# Altium schematic sheet SoC_Supply_GND.SchDoc: RFSoC AMC
size 420 x 297 mm; CompanyName: WUT; DrawnBy: T. Przywozki; Organization: WUT ISE; Address1: Warsaw University of Technology; Address2: Nowowiejska 15/19 00-665 Warsaw; Address3: Tomasz.Przywozki@pw.edu.pl; DocumentNumber: 13; Revision: 1; SheetNumber: 13; SheetTotal: 45; Project: RFSoC AMC; ModifiedBy: T. Przywozki; CreateDate: -; CheckedDate: -; DivGrp: ISE; Designer: T. Przywozki; ModifiedDate: -; ProjectName: ADC/DAC MEZZANINE
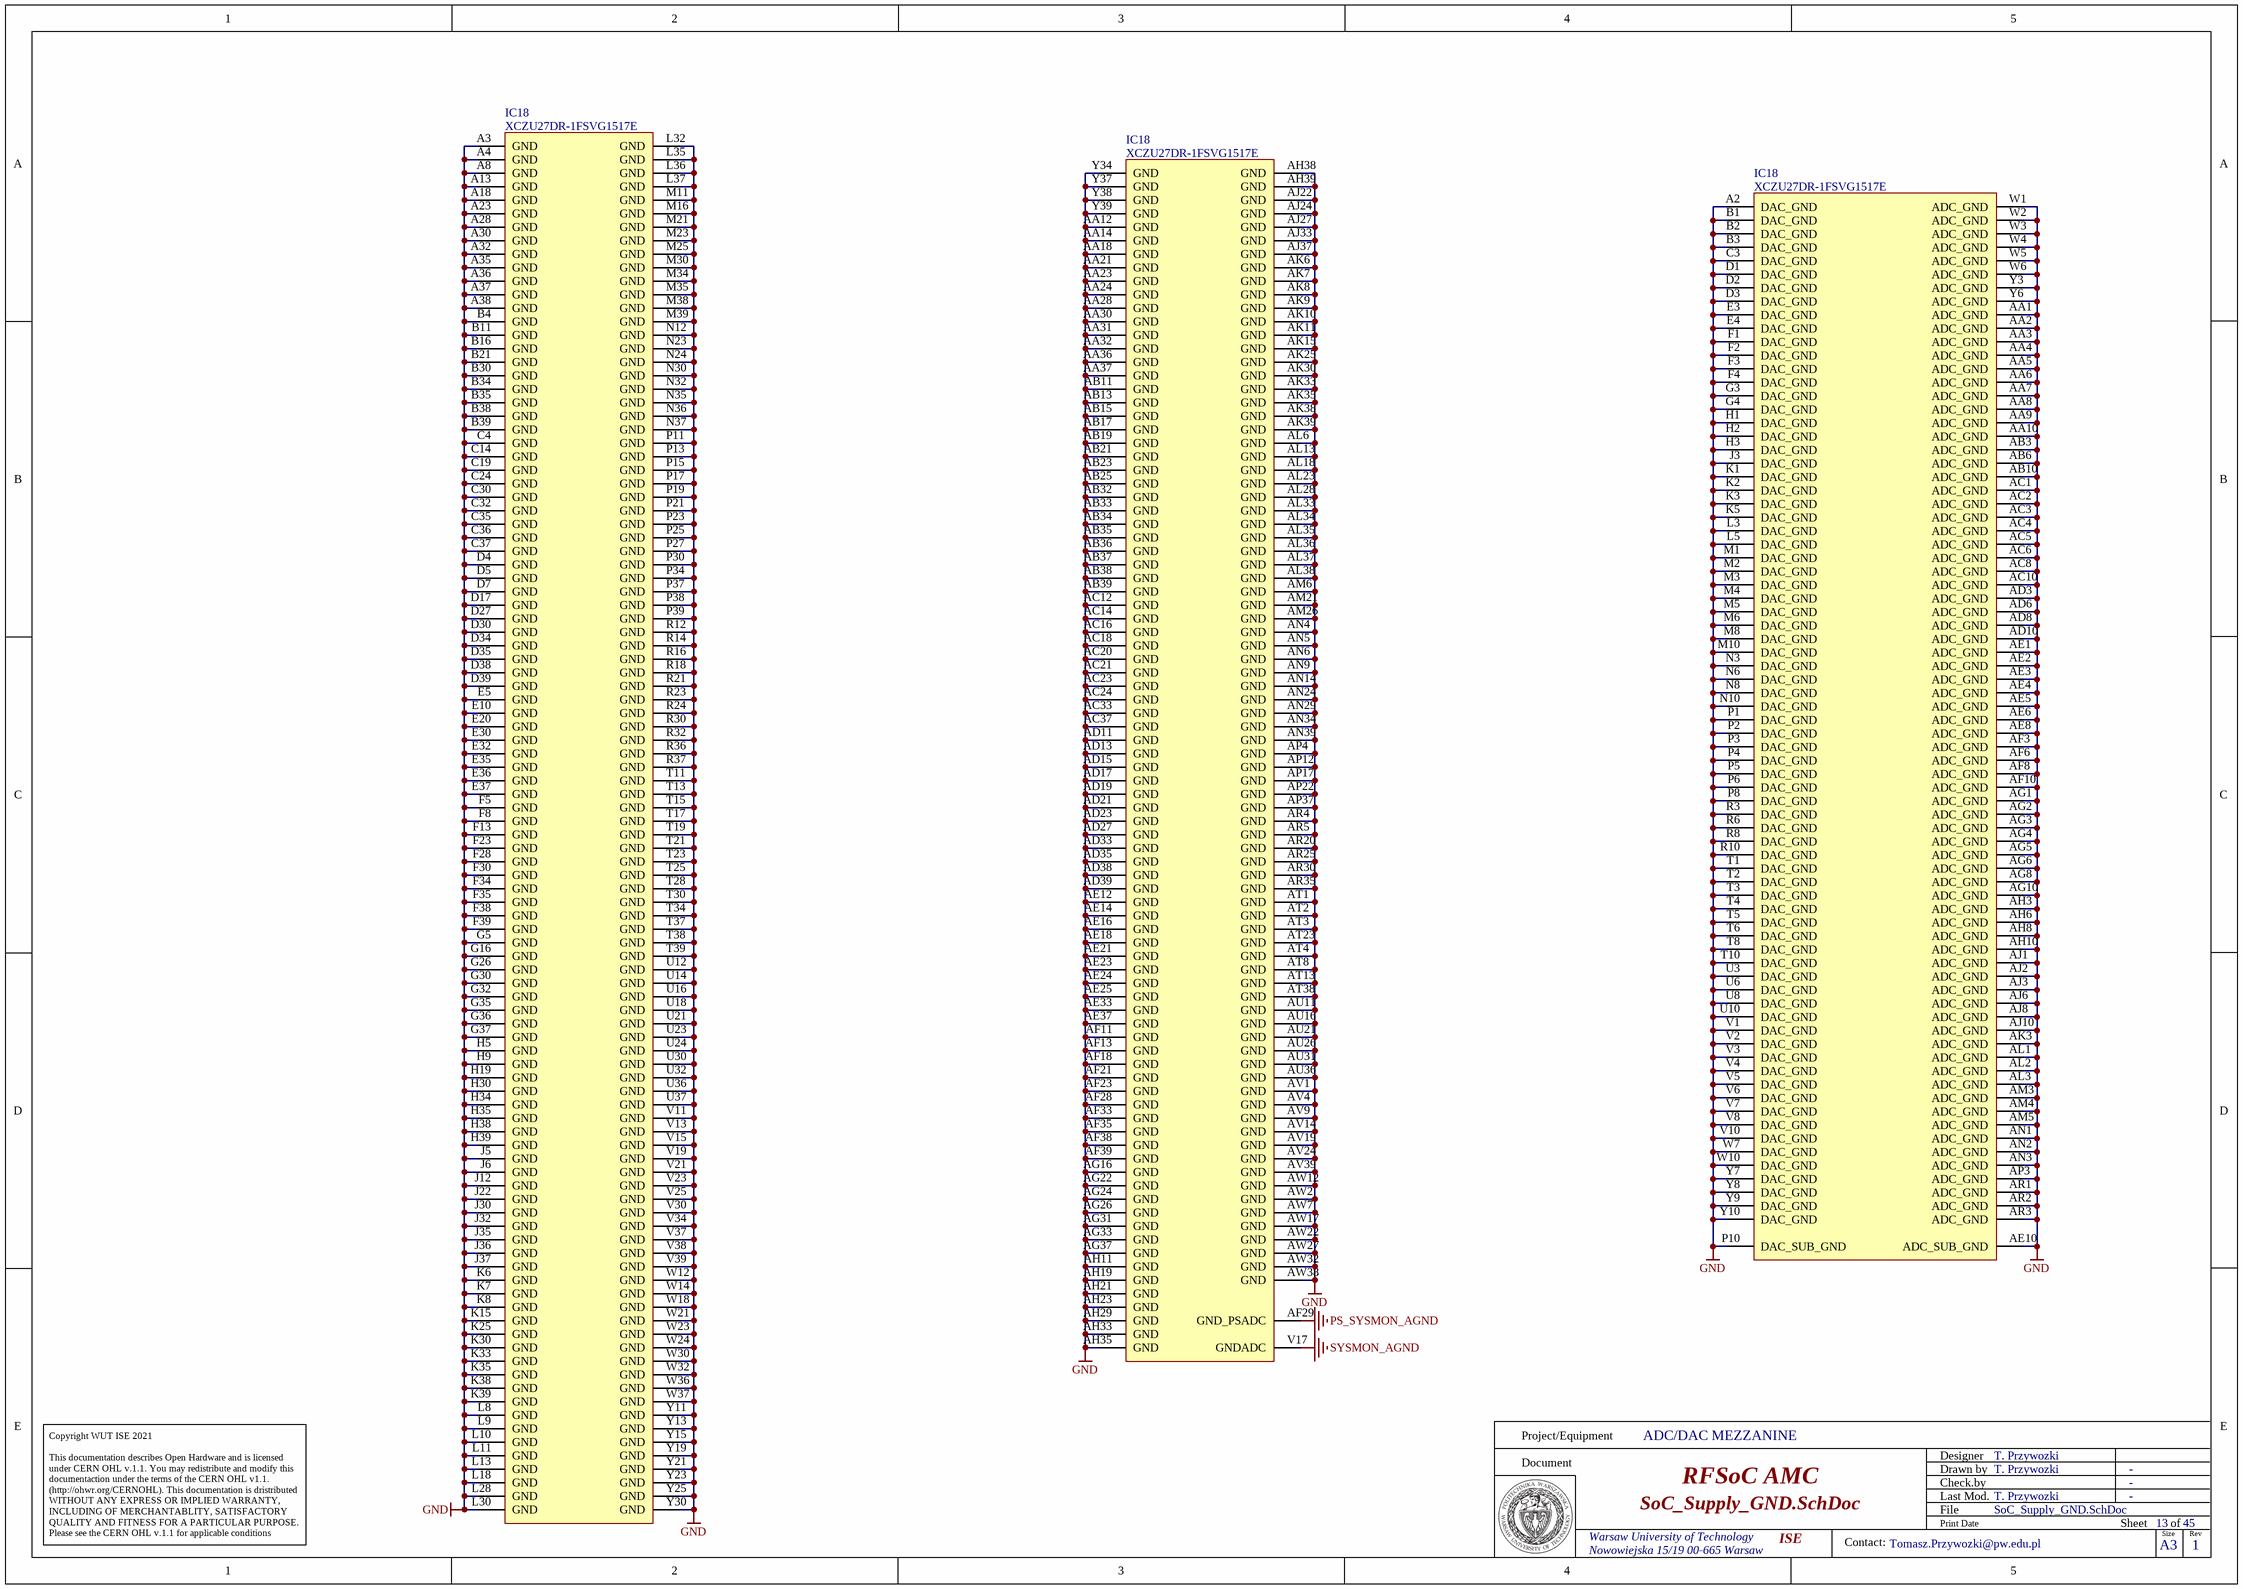
[diagram p0: SoC_Supply_GND.SchDoc]

## Parts
IC18  XCZU27DR-1FSVG1517E  [XILINX_FSVG1517 (XCZU27DR)]  (parts 29,30,31 of 31)

## Nets
GND: IC18.A2(DAC_GND) IC18.A3(GND) IC18.A4(GND) IC18.A8(GND) IC18.A13(GND) IC18.A18(GND) IC18.A23(GND) IC18.A28(GND) IC18.A30(GND) IC18.A32(GND) IC18.A35(GND) IC18.A36(GND) IC18.A37(GND) IC18.A38(GND) IC18.AA1(ADC_GND) IC18.AA2(ADC_GND) IC18.AA3(ADC_GND) IC18.AA4(ADC_GND) IC18.AA5(ADC_GND) IC18.AA6(ADC_GND) IC18.AA7(ADC_GND) IC18.AA8(ADC_GND) IC18.AA9(ADC_GND) IC18.AA10(ADC_GND) IC18.AA12(GND) IC18.AA14(GND) IC18.AA18(GND) IC18.AA21(GND) IC18.AA23(GND) IC18.AA24(GND) IC18.AA28(GND) IC18.AA30(GND) IC18.AA31(GND) IC18.AA32(GND) IC18.AA36(GND) IC18.AA37(GND) IC18.AB3(ADC_GND) IC18.AB6(ADC_GND) IC18.AB10(ADC_GND) IC18.AB11(GND) IC18.AB13(GND) IC18.AB15(GND) IC18.AB17(GND) IC18.AB19(GND) IC18.AB21(GND) IC18.AB23(GND) IC18.AB25(GND) IC18.AB32(GND) IC18.AB33(GND) IC18.AB34(GND) IC18.AB35(GND) IC18.AB36(GND) IC18.AB37(GND) IC18.AB38(GND) IC18.AB39(GND) IC18.AC1(ADC_GND) IC18.AC2(ADC_GND) IC18.AC3(ADC_GND) IC18.AC4(ADC_GND) IC18.AC5(ADC_GND) IC18.AC6(ADC_GND) IC18.AC8(ADC_GND) IC18.AC10(ADC_GND) IC18.AC12(GND) IC18.AC14(GND) IC18.AC16(GND) IC18.AC18(GND) IC18.AC20(GND) IC18.AC21(GND) IC18.AC23(GND) IC18.AC24(GND) IC18.AC33(GND) IC18.AC37(GND) IC18.AD3(ADC_GND) IC18.AD6(ADC_GND) IC18.AD8(ADC_GND) IC18.AD10(ADC_GND) IC18.AD11(GND) IC18.AD13(GND) IC18.AD15(GND) IC18.AD17(GND) IC18.AD19(GND) IC18.AD21(GND) IC18.AD23(GND) IC18.AD27(GND) IC18.AD33(GND) IC18.AD35(GND) IC18.AD38(GND) IC18.AD39(GND) IC18.AE1(ADC_GND) IC18.AE2(ADC_GND) IC18.AE3(ADC_GND) IC18.AE4(ADC_GND) IC18.AE5(ADC_GND) IC18.AE6(ADC_GND) IC18.AE8(ADC_GND) IC18.AE10(ADC_SUB_GND) IC18.AE12(GND) IC18.AE14(GND) IC18.AE16(GND) IC18.AE18(GND) IC18.AE21(GND) IC18.AE23(GND) IC18.AE24(GND) IC18.AE25(GND) IC18.AE33(GND) IC18.AE37(GND) IC18.AF3(ADC_GND) IC18.AF6(ADC_GND) IC18.AF8(ADC_GND) IC18.AF10(ADC_GND) IC18.AF11(GND) IC18.AF13(GND) IC18.AF18(GND) IC18.AF21(GND) IC18.AF23(GND) IC18.AF28(GND) IC18.AF33(GND) IC18.AF35(GND) IC18.AF38(GND) IC18.AF39(GND) IC18.AG1(ADC_GND) IC18.AG2(ADC_GND) IC18.AG3(ADC_GND) IC18.AG4(ADC_GND) IC18.AG5(ADC_GND) IC18.AG6(ADC_GND) IC18.AG8(ADC_GND) IC18.AG10(ADC_GND) IC18.AG16(GND) IC18.AG22(GND) IC18.AG24(GND) IC18.AG26(GND) IC18.AG31(GND) IC18.AG33(GND) IC18.AG37(GND) IC18.AH3(ADC_GND) IC18.AH6(ADC_GND) IC18.AH8(ADC_GND) IC18.AH10(ADC_GND) IC18.AH11(GND) IC18.AH19(GND) IC18.AH21(GND) IC18.AH23(GND) IC18.AH29(GND) IC18.AH33(GND) IC18.AH35(GND) IC18.AH38(GND) IC18.AH39(GND) IC18.AJ1(ADC_GND) IC18.AJ2(ADC_GND) IC18.AJ3(ADC_GND) IC18.AJ6(ADC_GND) IC18.AJ8(ADC_GND) IC18.AJ10(ADC_GND) IC18.AJ22(GND) IC18.AJ24(GND) IC18.AJ27(GND) IC18.AJ33(GND) IC18.AJ37(GND) IC18.AK3(ADC_GND) IC18.AK6(GND) IC18.AK7(GND) IC18.AK8(GND) IC18.AK9(GND) IC18.AK10(GND) IC18.AK11(GND) IC18.AK15(GND) IC18.AK25(GND) IC18.AK30(GND) IC18.AK33(GND) IC18.AK35(GND) IC18.AK38(GND) IC18.AK39(GND) IC18.AL1(ADC_GND) IC18.AL2(ADC_GND) IC18.AL3(ADC_GND) IC18.AL6(GND) IC18.AL13(GND) IC18.AL18(GND) IC18.AL23(GND) IC18.AL28(GND) IC18.AL33(GND) IC18.AL34(GND) IC18.AL35(GND) IC18.AL36(GND) IC18.AL37(GND) IC18.AL38(GND) IC18.AM3(ADC_GND) IC18.AM4(ADC_GND) IC18.AM5(ADC_GND) IC18.AM6(GND) IC18.AM21(GND) IC18.AM26(GND) IC18.AN1(ADC_GND) IC18.AN2(ADC_GND) IC18.AN3(ADC_GND) IC18.AN4(GND) IC18.AN5(GND) IC18.AN6(GND) IC18.AN9(GND) IC18.AN14(GND) IC18.AN24(GND) IC18.AN29(GND) IC18.AN34(GND) IC18.AN39(GND) IC18.AP3(ADC_GND) IC18.AP4(GND) IC18.AP12(GND) IC18.AP17(GND) IC18.AP22(GND) IC18.AP37(GND) IC18.AR1(ADC_GND) IC18.AR2(ADC_GND) IC18.AR3(ADC_GND) IC18.AR4(GND) IC18.AR5(GND) IC18.AR20(GND) IC18.AR25(GND) IC18.AR30(GND) IC18.AR35(GND) IC18.AT1(GND) IC18.AT2(GND) IC18.AT3(GND) IC18.AT4(GND) IC18.AT8(GND) IC18.AT13(GND) IC18.AT23(GND) IC18.AT38(GND) IC18.AU11(GND) IC18.AU16(GND) IC18.AU21(GND) IC18.AU26(GND) IC18.AU31(GND) IC18.AU36(GND) IC18.AV1(GND) IC18.AV4(GND) IC18.AV9(GND) IC18.AV14(GND) IC18.AV19(GND) IC18.AV24(GND) IC18.AV39(GND) IC18.AW2(GND) IC18.AW7(GND) IC18.AW12(GND) IC18.AW17(GND) IC18.AW22(GND) IC18.AW27(GND) IC18.AW32(GND) IC18.AW38(GND) IC18.B1(DAC_GND) IC18.B2(DAC_GND) IC18.B3(DAC_GND) IC18.B4(GND) IC18.B11(GND) IC18.B16(GND) IC18.B21(GND) IC18.B30(GND) IC18.B34(GND) IC18.B35(GND) IC18.B38(GND) IC18.B39(GND) IC18.C3(DAC_GND) IC18.C4(GND) IC18.C14(GND) IC18.C19(GND) IC18.C24(GND) IC18.C30(GND) IC18.C32(GND) IC18.C35(GND) IC18.C36(GND) IC18.C37(GND) IC18.D1(DAC_GND) IC18.D2(DAC_GND) IC18.D3(DAC_GND) IC18.D4(GND) IC18.D5(GND) IC18.D7(GND) IC18.D17(GND) IC18.D27(GND) IC18.D30(GND) IC18.D34(GND) IC18.D35(GND) IC18.D38(GND) IC18.D39(GND) IC18.E3(DAC_GND) IC18.E4(DAC_GND) IC18.E5(GND) IC18.E10(GND) IC18.E20(GND) IC18.E30(GND) IC18.E32(GND) IC18.E35(GND) IC18.E36(GND) IC18.E37(GND) IC18.F1(DAC_GND) IC18.F2(DAC_GND) IC18.F3(DAC_GND) IC18.F4(DAC_GND) IC18.F5(GND) IC18.F8(GND) IC18.F13(GND) IC18.F23(GND) IC18.F28(GND) IC18.F30(GND) IC18.F34(GND) IC18.F35(GND) IC18.F38(GND) IC18.F39(GND) IC18.G3(DAC_GND) IC18.G4(DAC_GND) IC18.G5(GND) IC18.G16(GND) IC18.G26(GND) IC18.G30(GND) IC18.G32(GND) IC18.G35(GND) IC18.G36(GND) IC18.G37(GND) IC18.H1(DAC_GND) IC18.H2(DAC_GND) IC18.H3(DAC_GND) IC18.H5(GND) IC18.H9(GND) IC18.H19(GND) IC18.H30(GND) IC18.H34(GND) IC18.H35(GND) IC18.H38(GND) IC18.H39(GND) IC18.J3(DAC_GND) IC18.J5(GND) IC18.J6(GND) IC18.J12(GND) IC18.J22(GND) IC18.J30(GND) IC18.J32(GND) IC18.J35(GND) IC18.J36(GND) IC18.J37(GND) IC18.K1(DAC_GND) IC18.K2(DAC_GND) IC18.K3(DAC_GND) IC18.K5(DAC_GND) IC18.K6(GND) IC18.K7(GND) IC18.K8(GND) IC18.K15(GND) IC18.K25(GND) IC18.K30(GND) IC18.K33(GND) IC18.K35(GND) IC18.K38(GND) IC18.K39(GND) IC18.L3(DAC_GND) IC18.L5(DAC_GND) IC18.L8(GND) IC18.L9(GND) IC18.L10(GND) IC18.L11(GND) IC18.L13(GND) IC18.L18(GND) IC18.L28(GND) IC18.L30(GND) IC18.L32(GND) IC18.L35(GND) IC18.L36(GND) IC18.L37(GND) IC18.M1(DAC_GND) IC18.M2(DAC_GND) IC18.M3(DAC_GND) IC18.M4(DAC_GND) IC18.M5(DAC_GND) IC18.M6(DAC_GND) IC18.M8(DAC_GND) IC18.M10(DAC_GND) IC18.M11(GND) IC18.M16(GND) IC18.M21(GND) IC18.M23(GND) IC18.M25(GND) IC18.M30(GND) IC18.M34(GND) IC18.M35(GND) IC18.M38(GND) IC18.M39(GND) IC18.N3(DAC_GND) IC18.N6(DAC_GND) IC18.N8(DAC_GND) IC18.N10(DAC_GND) IC18.N12(GND) IC18.N23(GND) IC18.N24(GND) IC18.N30(GND) IC18.N32(GND) IC18.N35(GND) IC18.N36(GND) IC18.N37(GND) IC18.P1(DAC_GND) IC18.P2(DAC_GND) IC18.P3(DAC_GND) IC18.P4(DAC_GND) IC18.P5(DAC_GND) IC18.P6(DAC_GND) IC18.P8(DAC_GND) IC18.P10(DAC_SUB_GND) IC18.P11(GND) IC18.P13(GND) IC18.P15(GND) IC18.P17(GND) IC18.P19(GND) IC18.P21(GND) IC18.P23(GND) IC18.P25(GND) IC18.P27(GND) IC18.P30(GND) IC18.P34(GND) IC18.P37(GND) IC18.P38(GND) IC18.P39(GND) IC18.R3(DAC_GND) IC18.R6(DAC_GND) IC18.R8(DAC_GND) IC18.R10(DAC_GND) IC18.R12(GND) IC18.R14(GND) IC18.R16(GND) IC18.R18(GND) IC18.R21(GND) IC18.R23(GND) IC18.R24(GND) IC18.R30(GND) IC18.R32(GND) IC18.R36(GND) IC18.R37(GND) IC18.T1(DAC_GND) IC18.T2(DAC_GND) IC18.T3(DAC_GND) IC18.T4(DAC_GND) IC18.T5(DAC_GND) IC18.T6(DAC_GND) IC18.T8(DAC_GND) IC18.T10(DAC_GND) IC18.T11(GND) IC18.T13(GND) IC18.T15(GND) IC18.T17(GND) IC18.T19(GND) IC18.T21(GND) IC18.T23(GND) IC18.T25(GND) IC18.T28(GND) IC18.T30(GND) IC18.T34(GND) IC18.T37(GND) IC18.T38(GND) IC18.T39(GND) IC18.U3(DAC_GND) IC18.U6(DAC_GND) IC18.U8(DAC_GND) IC18.U10(DAC_GND) IC18.U12(GND) IC18.U14(GND) IC18.U16(GND) IC18.U18(GND) IC18.U21(GND) IC18.U23(GND) IC18.U24(GND) IC18.U30(GND) IC18.U32(GND) IC18.U36(GND) IC18.U37(GND) IC18.V1(DAC_GND) IC18.V2(DAC_GND) IC18.V3(DAC_GND) IC18.V4(DAC_GND) IC18.V5(DAC_GND) IC18.V6(DAC_GND) IC18.V7(DAC_GND) IC18.V8(DAC_GND) IC18.V10(DAC_GND) IC18.V11(GND) IC18.V13(GND) IC18.V15(GND) IC18.V19(GND) IC18.V21(GND) IC18.V23(GND) IC18.V25(GND) IC18.V30(GND) IC18.V34(GND) IC18.V37(GND) IC18.V38(GND) IC18.V39(GND) IC18.W1(ADC_GND) IC18.W2(ADC_GND) IC18.W3(ADC_GND) IC18.W4(ADC_GND) IC18.W5(ADC_GND) IC18.W6(ADC_GND) IC18.W7(DAC_GND) IC18.W10(DAC_GND) IC18.W12(GND) IC18.W14(GND) IC18.W18(GND) IC18.W21(GND) IC18.W23(GND) IC18.W24(GND) IC18.W30(GND) IC18.W32(GND) IC18.W36(GND) IC18.W37(GND) IC18.Y3(ADC_GND) IC18.Y6(ADC_GND) IC18.Y7(DAC_GND) IC18.Y8(DAC_GND) IC18.Y9(DAC_GND) IC18.Y10(DAC_GND) IC18.Y11(GND) IC18.Y13(GND) IC18.Y15(GND) IC18.Y19(GND) IC18.Y21(GND) IC18.Y23(GND) IC18.Y25(GND) IC18.Y30(GND) IC18.Y34(GND) IC18.Y37(GND) IC18.Y38(GND) IC18.Y39(GND)
PS_SYSMON_AGND: IC18.AF29(GND_PSADC)
SYSMON_AGND: IC18.V17(GNDADC)

## Notes on the sheet
- Project/Equipment
- Document
- Designer
- Drawn by
- Check.by
- Copyright WUT ISE 2021
  This documentation describes Open Hardware and is licensed under CERN OHL v.1.1. You may redistribute and modify this documentaction under the terms of the CERN OHL v1.1.
  (http://ohwr.org/CERNOHL). This documentation is dristributed WITHOUT ANY EXPRESS OR IMPLIED WARRANTY, INCLUDING OF MERCHANTABLITY, SATISFACTORY QUALITY AND FITNESS FOR A PARTICULAR PURPOSE. Please see the CERN OHL v.1.1 for applicable conditions
- File
- Last Mod.
- Print Date
- Sheet
- Size
- A3
- of
- Rev
- Contact:

## Library data of the parts
IC18 = XCZU27DR-1FSVG1517E: Zynq UltraScale+ RFSoC, Quad-Core ARM® Cortex™-A53 MPCore™ up to 1.5GHz, 214 PS I/O, 299 HP I/O, 48 HD I/O, 1517-Pin BGA; Manufacturer: XILINX; PressFit: No; Bonding: No; Part Number: XCZU27DR-1FSVG1517E; Component Kind: Standard; Component Type: Standard; Device: XCZU27DR-1FSVG1517E; PackageDescription: BGA, 1.00mm Pitch, Square; 1517 Pin, 39 Columns X 39 Rows, 40.00mm X 40.00mm X 4.01mm H; Part Description: Zynq UltraScale+ RFSoC, Quad-Core ARM® Cortex™-A53 MPCore™ up to 1.5GHz, 214 PS I/O, 299 HP I/O, 48 HD I/O, 1517-Pin BGA; Manufacturer Part Number: XCZU27DR-1FSVG1517E; Pin Count: 1517; Case: BGA1517; Mounted: Yes; Socket: No; SMD: Yes; Sense: No; ComponentHeight: 4.01mm; HelpURL: \\cern.ch\dfs\Applications\Altium\Datasheets\XCZU27DR-1FSVG1517E.pdf; ComponentLink1URL: \\cern.ch\dfs\Applications\Altium\Datasheets\XCZU27DR-1FSVG1517E_Package-Pinout.pdf; ComponentLink1Description: Package/Pinout; ComponentLink2URL: \\cern.ch\dfs\Applications\Altium\Datasheets\XCZU27DR-1FSVG1517E_Pinout.pdf; ComponentLink2Description: Pinout; Author: CERN DEM MR; CreateDate: 02/05/2018; LatestRevisionDate: 02/05/2018